# EAGLE design Camera driver (EAGLE 7.2.0)
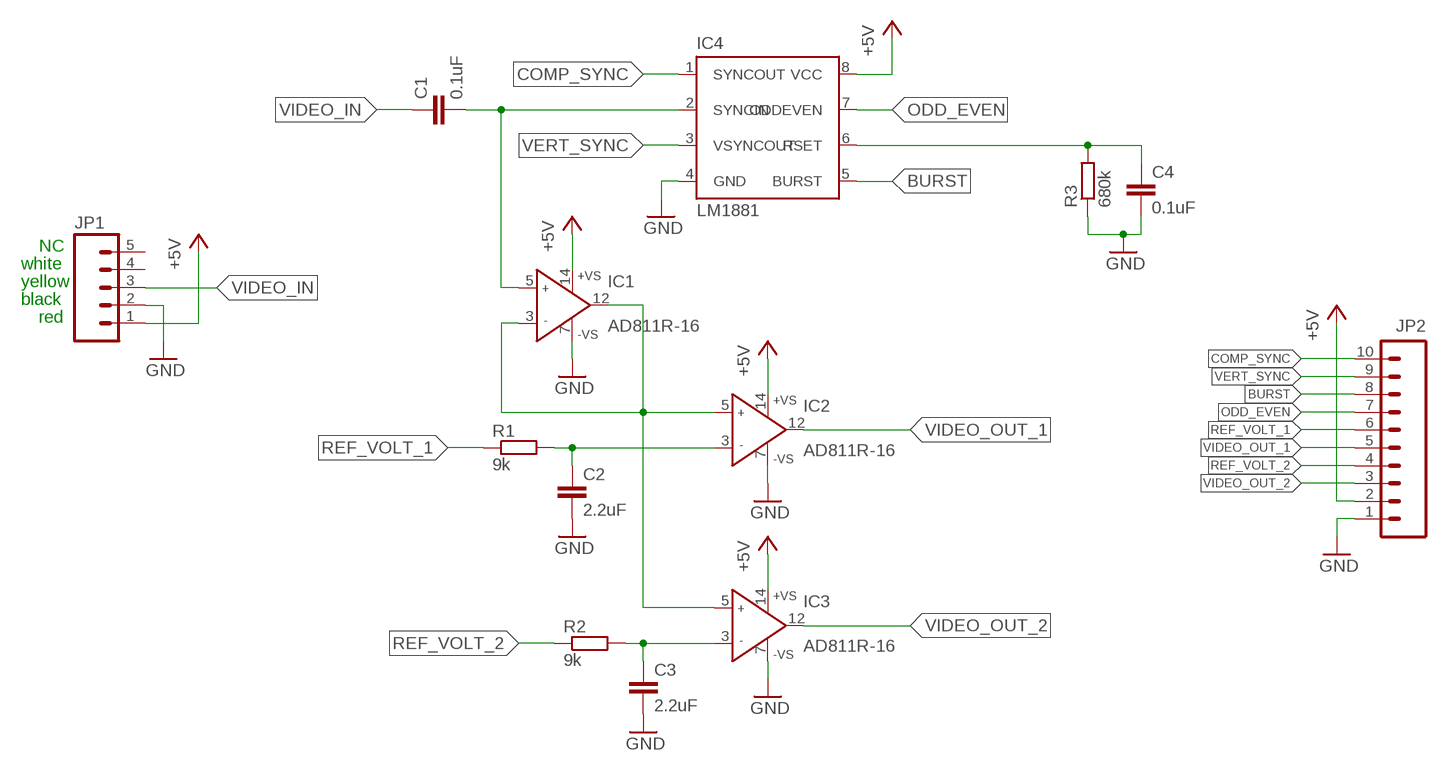
[diagram p0: schematic, sheet 1]

## Parts
C1  0.1uF  C-EUC0603  [C0603]
C2  2.2uF  C-EUC0603  [C0603]
C3  2.2uF  C-EUC0603  [C0603]
C4  0.1uF  C-EUC0603  [C0603]
IC1  AD811R-16  [SOIC16R]
IC2  AD811R-16  [SOIC16R]
IC3  AD811R-16  [SOIC16R]
IC4  LM1881  [DIL08]
JP1  M05PTH  [1X05]
JP2  M10SILK_FEMALE_PTH  [1X10]
R1  9k  R-EU_R0603  [R0603]
R2  9k  R-EU_R0603  [R0603]
R3  680k  R-EU_R0603  [R0603]

## Nets
+5V: IC1.14(+VS) IC2.14(+VS) IC3.14(+VS) IC4.8(VCC) JP1.1 JP2.2
BURST: IC4.5(BURST) JP2.8
COMP_SYNC: IC4.1(SYNCOUT) JP2.10
GND: C2.2 C3.2 C4.2 IC1.7(-VS) IC2.7(-VS) IC3.7(-VS) IC4.4(GND) JP1.2 JP2.1 R3.1
N$1: IC1.3(IN-) IC1.12(OUT) IC2.5(IN+) IC3.5(IN+)
N$2: C4.1 IC4.6(RSET) R3.2
N$3: C3.1 IC3.3(IN-) R2.2
N$4: C1.2 IC1.5(IN+) IC4.2(SYNCIN)
N$5: C2.1 IC2.3(IN-) R1.2
ODD_EVEN: IC4.7(ODDEVEN) JP2.7
REF_VOLT_1: JP2.6 R1.1
REF_VOLT_2: JP2.4 R2.1
VERT_SYNC: IC4.3(VSYNCOUT) JP2.9
VIDEO_IN: C1.1 JP1.3
VIDEO_OUT_1: IC2.12(OUT) JP2.5
VIDEO_OUT_2: IC3.12(OUT) JP2.3
Unconnected: JP1.4 JP1.5

## Notes on the sheet
- NC
- white
- yellow
- black
- red

## Library data of the parts
C1-C4 = resistor:C-EU: CAPACITOR, European symbol
IC1-IC3 = analog-devices:AD811: High Performance Video Op Amp Source: http://www.analog.com/static/imported-files/data_sheets/AD811.pdf; MF: ALTERA CORPORATION; MPN: AD811ARZ-16; OC_FARNELL: unknown; OC_NEWARK: 59K6371
IC4 = lm1881:LM1881
JP1 = SparkFun-Connectors:M05: Header 5 Standard 5-pin 0.1" header. Use with straight break away headers (SKU : PRT-00116), right angle break away headers (PRT-00553), swiss pins (PRT-00743), machine pins (PRT-00117), and female headers (PRT-00115). Molex polarized connector foot print use with SKU : PRT-08230 with associated crimp pins and housings.
JP2 = SparkFun-Connectors:M10: Header 10 Standard 10-pin 0.1" header. Use with straight break away headers (SKU : PRT-00116), right angle break away headers (PRT-00553), swiss pins (PRT-00743), machine pins (PRT-00117), and female headers (PRT-00115).; PROD_ID: CONN-11563
R1-R3 = resistor:R-EU_: RESISTOR, European symbol

## Board
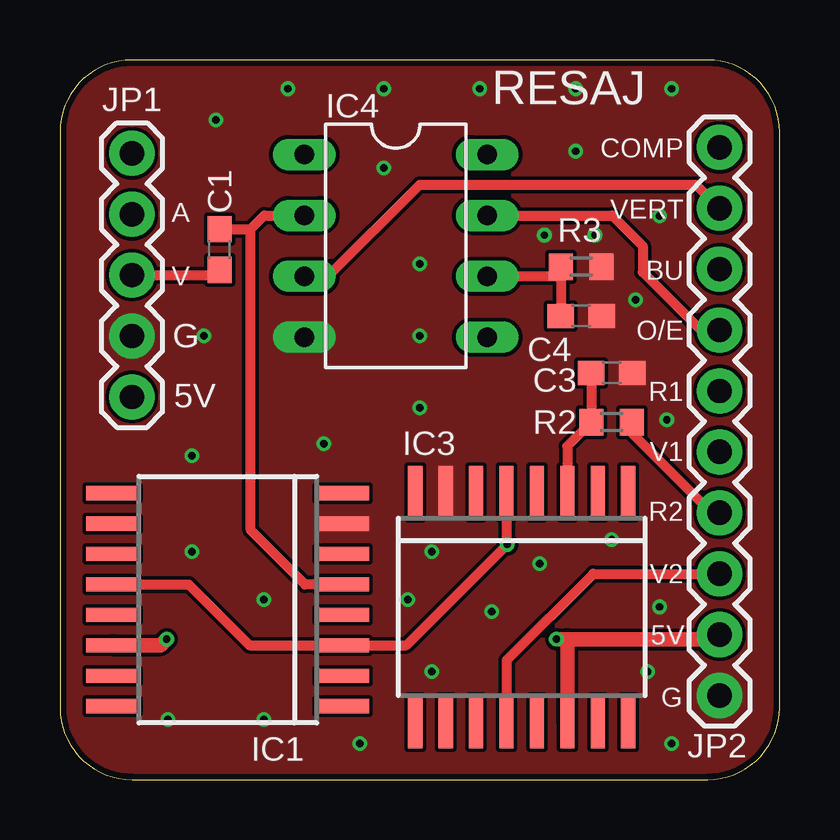
[diagram p1: board, top side]
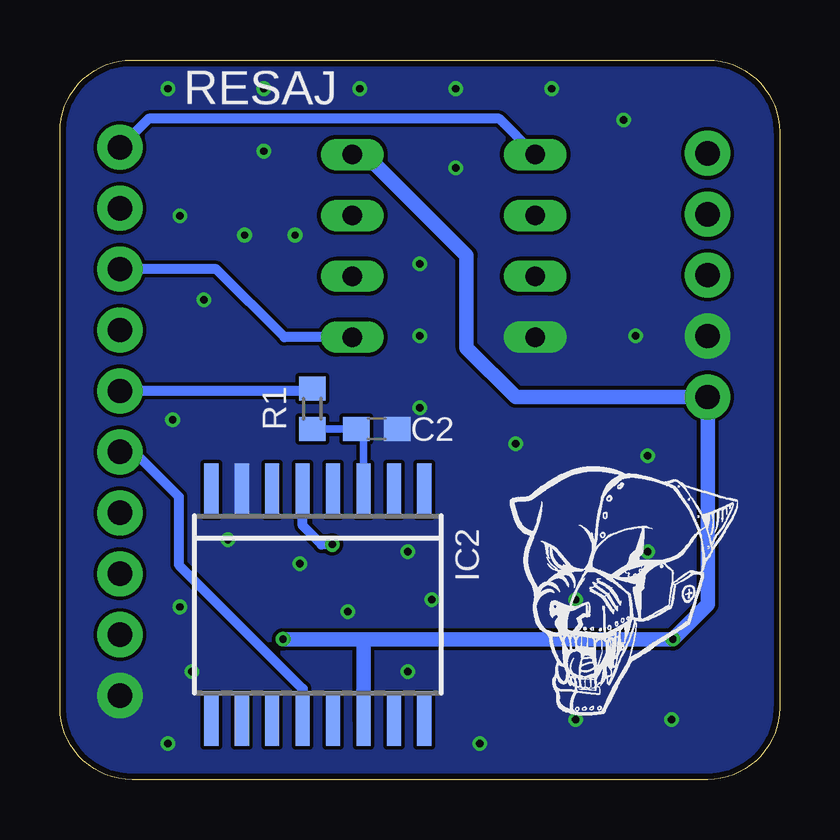
[diagram p2: board, bottom side, seen from below]

Size 30 x 30 mm. Coordinates in mm from the lower left corner, seen from the top.
Outline: 27,30 3,30 arc90 0,27 0,3 arc90 3,0 27,0 arc90 30,3 30,27 arc90 27,30
Copper layers (1*16): Top 0.035mm / dielectric 1.5mm / Bottom 0.035mm
Design rules "MakerStudio": minimum track width 6mil, minimum drill 12mil, track to track 6mil, track to pad 6mil, pad to pad 6mil, via to via 6mil, smd to smd 0mil, copper to edge 10mil, drill to drill 10mil, minimum pad ring 10mil, minimum via ring 6mil, stop-mask expansion 2mil, vias tented up to drill 100mil, thermal gap 10mil

### Footprints (pad centres in the part's own frame; a part is rotated, then mirrored left to right if it is on the bottom)
C0603 = smd 1.1 x 1: 1 -0.85,0; 2 0.85,0
SOIC16R = smd 0.6 x 2.2: 1 -4.445,-4.775; 2 -3.175,-4.775; 3 -1.905,-4.775; 4 -0.635,-4.775; 5 0.635,-4.775; 6 1.905,-4.775; 7 3.175,-4.775; 8 4.445,-4.775; 9 4.445,4.8; 10 3.175,4.8; 11 1.905,4.8; 12 0.635,4.8; 13 -0.635,4.8; 14 -1.905,4.8; 15 -3.175,4.8; 16 -4.445,4.8
DIL08 = drill 0.813 long: 1 -3.81,-3.81; 2 -1.27,-3.81; 3 1.27,-3.81; 4 3.81,-3.81; 5 3.81,3.81; 6 1.27,3.81; 7 -1.27,3.81; 8 -3.81,3.81
1X05 = drill 1.016 pad 1.88: 1 0,0; 2 2.54,0; 3 5.08,0; 4 7.62,0; 5 10.16,0
1X10 = drill 1.016 pad 1.88: 1 0,0; 2 2.54,0; 3 5.08,0; 4 7.62,0; 5 10.16,0; 6 12.7,0; 7 15.24,0; 8 17.78,0; 9 20.32,0; 10 22.86,0
R0603 = smd 1 x 1.1: 1 -0.85,0; 2 0.85,0

### Placement (x,y rotation side)
C1  6.65,22.1 90 top
C2  16.79,14.62 0 bottom
C3  23,16.95 0 top
C4  21.73,19.32 0 top
IC1  7,7.5 90 top
IC2  19.25,7.3 180 bottom
IC3  19.25,7.2 180 top
IC4  14,22.25 270 top
JP1  3,15.95 90 top
JP2  27.5,3.5 90 top
R1  19.48,15.46 270 bottom
R2  23,14.9 180 top
R3  21.73,21.38 180 top
U$1  [LOGO_PUMA_10X10]  6.6,7.9 0 bottom

### Tracks (layer width: path | path; a pad name or v marks a point on that pad's centre or on a via)
+5V  (via drill 0.3)
  Top 0.61: IC1.14 4.2,5.59 v4.45,5.85 | v20.7,5.85 21.15,5.85 | IC3.14 21.16,5.84 21.15,5.85 | 21.15,5.85 27.31,5.85 JP2.2
  Bottom 0.61: IC4.8 17.26,26.06 13.05,21.85 13.05,18 11,15.95 JP1.1 3,7.3 v4.45,5.85 17.35,5.85 | 17.35,5.85 v20.7,5.85 | IC2.14 17.34,5.84 17.35,5.85
BURST
  Bottom 0.406: IC4.5 20.64,18.44 23.48,21.28 JP2.8
COMP_SYNC
  Bottom 0.406: IC4.1 11.68,27.55 26.31,27.55 JP2.10
GND  (via drill 0.3)
  other vias: 6,18.5 6.5,27.5 13.5,25.5 17.5,28.8 21.5,28.8 25.5,28.8 13.5,28.8 9.5,28.8 21.5,26.2 25,23.5 22.3,22.7 20.2,22.7 15,21.5 15,18.5 15,15.5 11,14 5.5,13.5 5.5,9.5 8.5,7.5 4.5,2.5 8.5,2.5 12.5,1.5 15.5,4.5 14.5,7.5 15.5,9.5 18,7 20,9 24,20 25.3,15 25,7.2 25.5,1.5 24.5,4.5 23,10
  pour Bottom (no thermals): 27,30 3,30 arc90 0,27 0,3 arc90 3,0 27,0 arc90 30,3 30,27 arc90
  pour Top (no thermals): 27,30 3,30 arc90 0,27 0,3 arc90 3,0 27,0 arc90 30,3 30,27 arc90
N$1  (via drill 0.3)
  Top 0.406: IC1.12 5.37,8.13 7.91,5.59 IC1.3 14.45,5.59 v18.65,9.8 18.61,9.84 IC3.5
  Bottom 0.406: v18.65,9.8 19.1,9.8 19.89,10.59 IC2.5
N$2
  Top 0.406: R3.2 20.88,20.85 | 20.88,20.85 C4.1 | IC4.6 20.75,20.98 20.88,20.85
N$3
  Top 0.406: C3.1 R2.2 21.16,13.9 IC3.3
N$4
  Top 0.406: IC1.5 10.21,8.13 7.95,10.4 7.95,22.95 | C1.2 7.95,22.95 | 7.95,22.95 8.52,23.52 IC4.2
N$5
  Bottom 0.305: R1.2 C2.1 17.34,14.32 IC2.3
ODD_EVEN
  Top 0.406: IC4.7 23.03,23.52 24.3,22.25 24.3,21.15 26.71,18.74 JP2.7
REF_VOLT_1
  Bottom 0.305: R1.1 19.52,16.27
  Bottom 0.406: 19.52,16.27 19.59,16.2 JP2.6
REF_VOLT_2
  Top 0.406: R2.1 23.85,14.45 27.18,11.12 JP2.4
VERT_SYNC
  Top 0.406: IC4.3 11.18,20.98 15,24.8 26.52,24.8 JP2.9
VIDEO_IN
  Top 0.406: JP1.3 6.43,21.03 C1.1
VIDEO_OUT_1
  Bottom 0.406: IC2.12 19.89,3.79 25.05,8.95 25.05,11.8 26.91,13.66 JP2.5
VIDEO_OUT_2
  Top 0.406: IC3.12 18.61,4.96 22.23,8.58 JP2.3

### Text on the board
tPlace: RESAJ | COMP | VERT | A | BU | V | O/E | G | R1 | 5V | V1 | R2 | V2 | 5V | G
bPlace: RESAJ